# Altium schematic sheet differential_lowpass.SchDoc: Differential low-pass filter
size A4
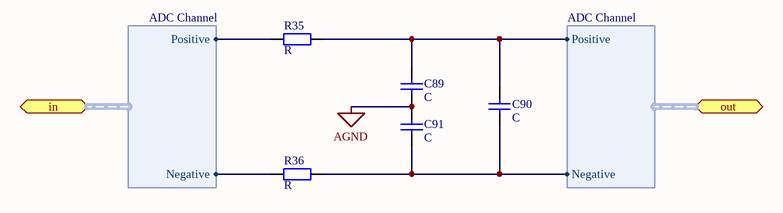
[diagram p0: differential_lowpass.SchDoc]

## Parts
C89  C  [C0603]
C90  C  [C0603]
C91  C  [C0603]
R35  R  [0603]
R36  R  [0603]

## Ports
in (harness ADC Channel), out (harness ADC Channel)

## Harnesses
ADC Channel: Positive, Negative

## Nets
AGND: C89.2 C91.1
NetC89_1: C89.1 C90.1 R35.2 ; port out.Positive
NetC90_2: C90.2 C91.2 R36.2 ; port out.Negative
NetR35_1: R35.1 ; port in.Positive
NetR36_1: R36.1 ; port in.Negative

## Notes on the sheet
- Title:
- Sheet:
- of
- Author:
- Model:
- Document Number:
- Checked by:
- Iss-Rev:
- Approved by:
- Date:
- File name:

## Library data of the parts
C89-C91 = Cap: Generic capacitor; value: C
R35 R36 = Res: Generic resistor; value: R